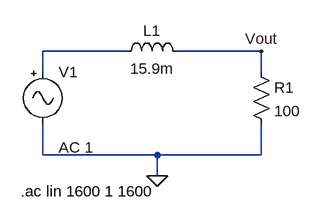
[diagram p0: schematic 3_12_pablo_gomez_tp6_ej3.asc]
3_12_pablo_gomez_tp6_ej3.asc, the LTspice schematic file:
Version 4
SHEET 1 880 680
WIRE 64 128 -64 128
WIRE 272 128 144 128
WIRE -64 160 -64 128
WIRE 272 160 272 128
WIRE -64 288 -64 240
WIRE 112 288 -64 288
WIRE 272 288 272 240
WIRE 272 288 112 288
WIRE 112 320 112 288
FLAG 272 128 Vout
FLAG 112 320 0
SYMBOL ind 48 144 R270
WINDOW 0 32 56 VTop 2
WINDOW 3 5 56 VBottom 2
SYMATTR InstName L1
SYMATTR Value 15.9m
SYMBOL res 256 144 R0
SYMATTR InstName R1
SYMATTR Value 100
SYMBOL Misc\\signal -64 144 R0
WINDOW 123 24 132 Left 2
WINDOW 39 0 0 Left 0
SYMATTR InstName V1
SYMATTR Value ""
SYMATTR Value2 AC 1
TEXT -98 344 Left 2 !.ac lin 1600 1 1600

The netlist it stands for:
* 3_12_pablo_gomez_tp6_ej3.asc
L1 N001 Vout 15.9m
R1 Vout 0 100
V1 N001 0 AC 1
.ac lin 1600 1 1600
.backanno
.end